# Altium schematic sheet LED Driver.SchDoc
size 420 x 297 mm; SheetNumber: 3; SheetTotal: 7
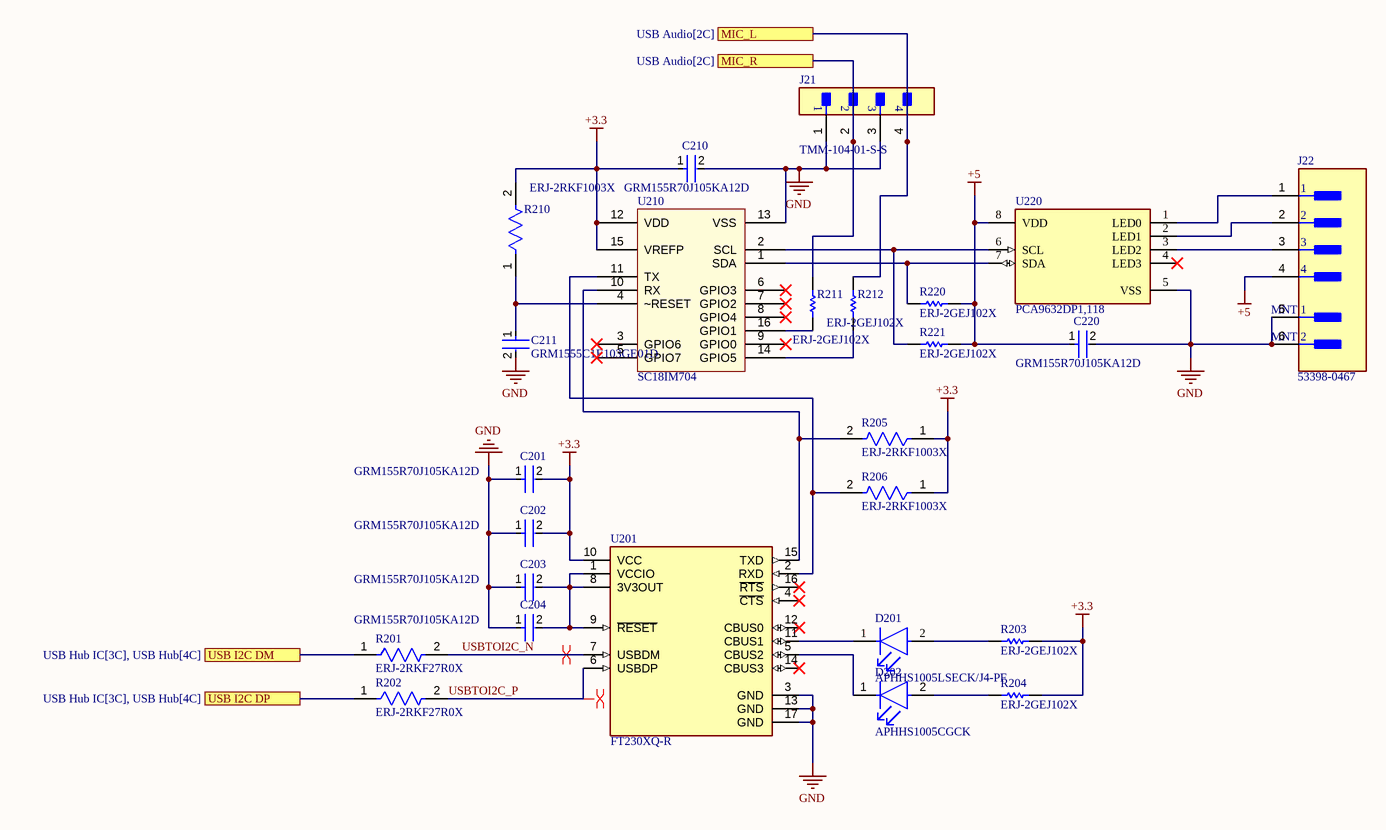
[diagram p0: LED Driver.SchDoc]

## Parts
C201  GRM155R70J105KA12D  [FP-GRM155-0_05-MFG]
C202  GRM155R70J105KA12D  [FP-GRM155-0_05-MFG]
C203  GRM155R70J105KA12D  [FP-GRM155-0_05-MFG]
C204  GRM155R70J105KA12D  [FP-GRM155-0_05-MFG]
C210  GRM155R70J105KA12D  [FP-GRM155-0_05-MFG]
C211  GRM1555C1E103GE01D  [FP-GRM155-0_15-IPC_B]
C220  GRM155R70J105KA12D  [FP-GRM155-0_05-MFG]
D201  APHHS1005LSECK/J4-PF  [FP-APHHS1005LSECK-J4-PF-MFG]
D202  APHHS1005CGCK  [FP-APHHS1005CGCK-MFG]
J21  TMM-104-01-S-S  [FP-TMM-104-01-S-S-MFG]
J22  53398-0467  [FP-53398-0467-MFG]
R201  ERJ-2RKF27R0X  [FP-ERJ2R-IPC_B]
R202  ERJ-2RKF27R0X  [FP-ERJ2R-IPC_B]
R203  ERJ-2GEJ102X  [RESC1005X40X25NL05T05]
R204  ERJ-2GEJ102X  [RESC1005X40X25NL05T05]
R205  ERJ-2RKF1003X  [FP-ERJ2RK-IPC_C]
R206  ERJ-2RKF1003X  [FP-ERJ2RK-IPC_C]
R210  ERJ-2RKF1003X  [FP-ERJ2RK-IPC_C]
R211  ERJ-2GEJ102X  [RESC1005X40X25NL05T05]
R212  ERJ-2GEJ102X  [RESC1005X40X25NL05T05]
R220  ERJ-2GEJ102X  [RESC1005X40X25NL05T05]
R221  ERJ-2GEJ102X  [RESC1005X40X25NL05T05]
U201  FT230XQ-R  [FP-QFN-16-MFG]
U210  SC18IM704  [TSSOP-16]
U220  PCA9632DP1,118  [FP-SOT505-1-IPC_C]

## Ports
MIC_L (see USB Audio[2C]), MIC_R (see USB Audio[2C]), USB I2C DM (see USB Hub IC[3C], USB Hub[4C]), USB I2C DP (see USB Hub IC[3C], USB Hub[4C])

## Nets
+3.3: C201.2 C202.2 C210.1 R203.2 R204.2 R205.1 R206.1 R210.2 U201.10(VCC) U210.12(VDD) U210.15(VREFP)
+5: C220.1 J22.4 R220.2 R221.2 U220.8(VDD)
GND: C201.1 C202.1 C203.1 C204.1 C210.2 C211.2 C220.2 J21.1 J21.3 J22.5(MNT_1) J22.6(MNT_2) U201.3(GND) U201.13(GND) U201.17(GND) U210.13(VSS) U220.5(VSS)
MIC_L: J21.4 R212.2 ; port MIC_L
MIC_R: J21.2 R211.2 ; port MIC_R
USB I2C DM: R201.1 ; port USB I2C DM
USB I2C DP: R202.1 ; port USB I2C DP
USBTOI2C_N: R201.2 U201.7(USBDM)
USBTOI2C_P: R202.2 U201.6(USBDP)
NetC203_2: C203.2 C204.2 U201.1(VCCIO) U201.8(3V3OUT) U201.9(~{RESET})
NetC211_1: C211.1 R210.1 U210.4(~RESET)
NetD201_1: D201.1(C) U201.11(CBUS1)
NetD201_2: D201.2(A) R203.1
NetD202_1: D202.1(C) U201.5(CBUS2)
NetD202_2: D202.2(A) R204.1
NetJ22_1: J22.1 U220.1(LED0)
NetJ22_2: J22.2 U220.2(LED1)
NetJ22_3: J22.3 U220.3(LED2)
NetR205_2: R205.2 U201.15(TXD) U210.10(RX)
NetR206_2: R206.2 U201.2(RXD) U210.11(TX)
NetR211_1: R211.1 U210.16(GPIO1)
NetR212_1: R212.1 U210.14(GPIO5)
NetR220_1: R220.1 U210.1(SDA) U220.7(SDA)
NetR221_1: R221.1 U210.2(SCL) U220.6(SCL)

Not connected (* = marked no-connect by the designer): U201 4(~{CTS})* 12(CBUS0)* 14(CBUS3)* 16(~{RTS})*; U210 3(GPIO6)* 5(GPIO7)* 6(GPIO3)* 7(GPIO2)* 8(GPIO4)* 9(GPIO0)*; U220 4(LED3)*

## Layout directives
differential pair: USBTOI2C_N, USBTOI2C_P

## Notes on the sheet
- CREATIVE COMMONS
- PUBLIC LICENSE:
- BARKOUR ROBOT
- CC BY-NC 4.0
- APPROVED
- DWG NO
- GOOGLE LLC
- FILE
- RELEASED
- 2024/05/09
- SIZE
- 1600 AMPHITHEATRE PARKWAY
- MOUNTAIN VIEW CA 94043
- A3
- SHEET
- OF
- THIS DESIGN IS BEING PROVIDED  FOR NON-COMMERCIAL USE ONLY. THE USE OF =SCIENTIST_NAME_POSSESSIVE NAME IN CONNECTION WITH THE DESIGN IS NOT INTENDED TO IMPLY THAT =SCIENTIST_NAME SPONSORS OR ENDORSES THE DESIGN, GOOGLE LLC, OR ANY OF GOOGLE LLC'S PRODUCTS OR SERVICES.

## Library data of the parts
C201-C204 C210 C220 = CMP-2008-04587-2: Chip Multilayer Ceramic Capacitors for General Purpose, 0402, 1.0uF, X7R, 15%, 10%, 6.3V; Capacitance: 1uF; Case Code (Metric): 1005; Min Operating Temperature: -55°C; Tolerance: 10%; Depth: 0.5mm; Max Operating Temperature: 125°C; Width: 0.5mm; Case Code (Imperial): 0402; Termination: SMD/SMT; Weight: 0.000212oz; Thickness: 0.022inch; Package Quantity: 10000; Packaging: Tape and Reel; Voltage Rating: 6.3V; Lead Free: Lead Free; Height: 0.5mm; Length: 1mm; Dielectric: X7R; Case/Package: 0402; Voltage Rating (DC): 6.3V; Material: Ceramic; Mount: Surface Mount
C211 = CMP-06035-007392-1: Chip Multilayer Ceramic Capacitors for General Purpose, 0402, 10000pF, C0G, 30ppm/°C, 2%, 25V
D201 = CMP-00682-82290958-1: APHHS1005LSECK/J4-PF LED Uni-Color SB. Orange 611nm 2-Pin SMD T/R; Forward Voltage: 1.8V; Reverse Voltage: 5V; Forward Current: 2mA; Viewing Angle: 120°; Max Junction Temperature (Tj): 115°C; Luminous Intensity: 40mcd; Wavelength: 605nm; Power Dissipation: 84mW; Min Operating Temperature: -40°C; Case/Package: 0402; RoHS: Non-Compliant; Max Operating Temperature: 85°C; Schedule B: 8541402000, 8541402000; NexarPartId: 82290958; Height: 600µm; Color: Orange
D202 = CMP-44529-000044-1: LED GREEN CLEAR CHIP SMD; Viewing Angle: 120°; Dominant Wavelength: 570nm; Test Current: 20mA; Luminous Intensity: 50mcd; Forward Voltage: 2.1V; Number of LEDs: 1; Lens Color: Clear; Packaging: Tape and Reel; Max Operating Temperature: 85°C; Illumination Color: Green; Length: 1mm; Mount: Surface Mount; Lens Style: Clear; Color: Green; Number of Pins: 2; Wavelength: 570nm; Case/Package: 0402; Width: 0.5mm; Package Quantity: 2000; Case Code (Metric): 1005; Height: 0.6mm; Lead Free: Lead Free; Case Code (Imperial): 0402; Forward Current: 20mA; Min Operating Temperature: -40°C
J21 = CMP-02766-001674-1: CONN HEADER VERT 4POS 2MM; Max Current Rating: 3.9A; Connector Type: Male Pin; Max Voltage Rating (AC): 500V; Number of Contacts: 4; Gender: Male; Color: Black; Packaging: Bulk; Orientation: Straight; Contact Mating Length: 0.126inch; Contact Plating: Gold; Max Operating Temperature: 125°C; Housing Color: Black; Contact Material: Bronze; Package Quantity: 1; Housing Material: Polymer; Radiation Hardening: No; Pitch: 2mm; Contact Type: Male Pin; Number of Positions: 4; Number of Rows: 1; Lead Free: Lead Free; Width: 1.97mm; Termination: Solder; Depth: 1.97mm; Series: FleXYZ™ TMM; RoHS Compliant: Yes; Length: 8mm; Min Operating Temperature: -55°C; Mount: Through Hole
J22 = CMP-04776-000301-1: CONN HEADER SMD 4POS 1.25MM; Contact Resistance: 20mR; Max Voltage Rating (AC): 125V; Current Rating: 1A; Number of Positions: 4; Mount: Surface Mount; Pitch: 1.25mm; Orientation: Straight; Housing Material: Nylon; Max Operating Temperature: 85°C; Packaging: Tape and Reel; RoHS Compliant: Yes; Contact Gender: Male; Min Operating Temperature: -40°C; Radiation Hardening: No; Number of Contacts: 4; Termination: Solder; Contact Plating: Tin; Voltage Rating: 125V; Number of Rows: 1; Contact Material: Bronze
R201 R202 = CMP-2002-00830-2: RES SMD 27 OHM 1% 1/10W 0402; Voltage Rating: 50V; Temperature Coefficient: 100ppm/°C; Resistance: 27R; Power Rating: 100mW; Military Standard: Not; Construction: Rectangular; Tolerance: 1%; Features: Automotive AEC-Q200; Length: 1mm; Lead Free: Lead Free; Mount: Surface Mount; Number of Terminations: 2; Radiation Hardening: No; Number of Pins: 2; Width: 0.5mm; Contact Plating: Tin; Voltage Rating (DC): 50V; Resistance Tolerance: 1%; Series: ERJ; Packaging: Tape and Reel; Case/Package: 0402; Technology: THICK FILM; REACH SVHC: No SVHC; Depth: 0.5mm; Resistor Type: Thick Film; Package Quantity: 1; Termination: SMD/SMT; Case Code (Imperial): 0402; Height: 0.35mm; Weight: 2.8E-05oz; Max Operating Temperature: 155°C; Case Code (Metric): 1005; Min Operating Temperature: -55°C; RoHS Compliant: Yes; Max Power Dissipation: 100mW
R203 R204 R211 R212 R220 R221 = CMP-2002-00432-1: Manufacturer: Panasonic; Part Number: ERJ-2GEJ102X
R205 R206 R210 = CMP-2002-00608-4: RES SMD 100K OHM 1% 1/10W 0402; Resistance: 100kR; Voltage Rating (DC): 50V; Power Rating: 100mW; Temperature Coefficient: 100ppm/°C; Case/Package: 0402; Length: 1mm; Package Quantity: 1; Radiation Hardening: No; Case Code (Metric): 1005; Contact Plating: Tin; Mount: Surface Mount; Depth: 0.5mm; Max Operating Temperature: 155°C; Lead Free: Lead Free; Width: 0.5mm; Composition: Thick Film; Case Code (Imperial): 0402; Tolerance: 1%; Termination: SMD/SMT; Number of Pins: 2; Height: 0.35mm; Voltage Rating: 50V; Military Standard: Not; REACH SVHC: No SVHC; Packaging: Tape and Reel; Min Operating Temperature: -55°C; Max Power Dissipation: 100mW; Features: Automotive AEC-Q200; Number of Terminations: 2
U201 = CMP-0248-00010-3: IC USB SERIAL BASIC UART 16QFN; Number of Channels: 1; Data Rate: 12Mbps; Operating Supply Current: 8mA; Max Supply Voltage: 5.5V; Operating Supply Voltage: 5V; Min Supply Voltage: 2.97V; Width: 4mm; Length: 4mm; Height: 0.75mm; Max Operating Temperature: 85°C; Interface: USB; Min Operating Temperature: -40°C; Package Quantity: 5000; Lead Free: Lead Free; Number of Pins: 16; Case/Package: QFN; Weight: 0.002014oz; Packaging: Tape and Reel; Mount: Surface Mount
U220 = CMP-10140-000008-1: IC LED DRVR LIN DIM 25MA 8TSSOP; Low Level Output Current: 100mA; Frequency: 400kHz; Power Dissipation: 400mW; Output Voltage: 5.5V; Number of Outputs: 4; Max Supply Current: 150uA; Min Supply Voltage: 2.3V; Package Quantity: 1; Number of Pins: 8; Max Power Dissipation: 400mW; Series: -; Max Supply Voltage: 5.5V; Lead Free: Lead Free; Radiation Hardening: No; Supply Current: 150uA; Nominal Supply Current: 150uA; Case/Package: TSSOP; Max Operating Temperature: 85°C; Mount: Surface Mount; Packaging: Tape and Reel; RoHS Compliant: Yes; Number of Segments: 4; Min Operating Temperature: -40°C